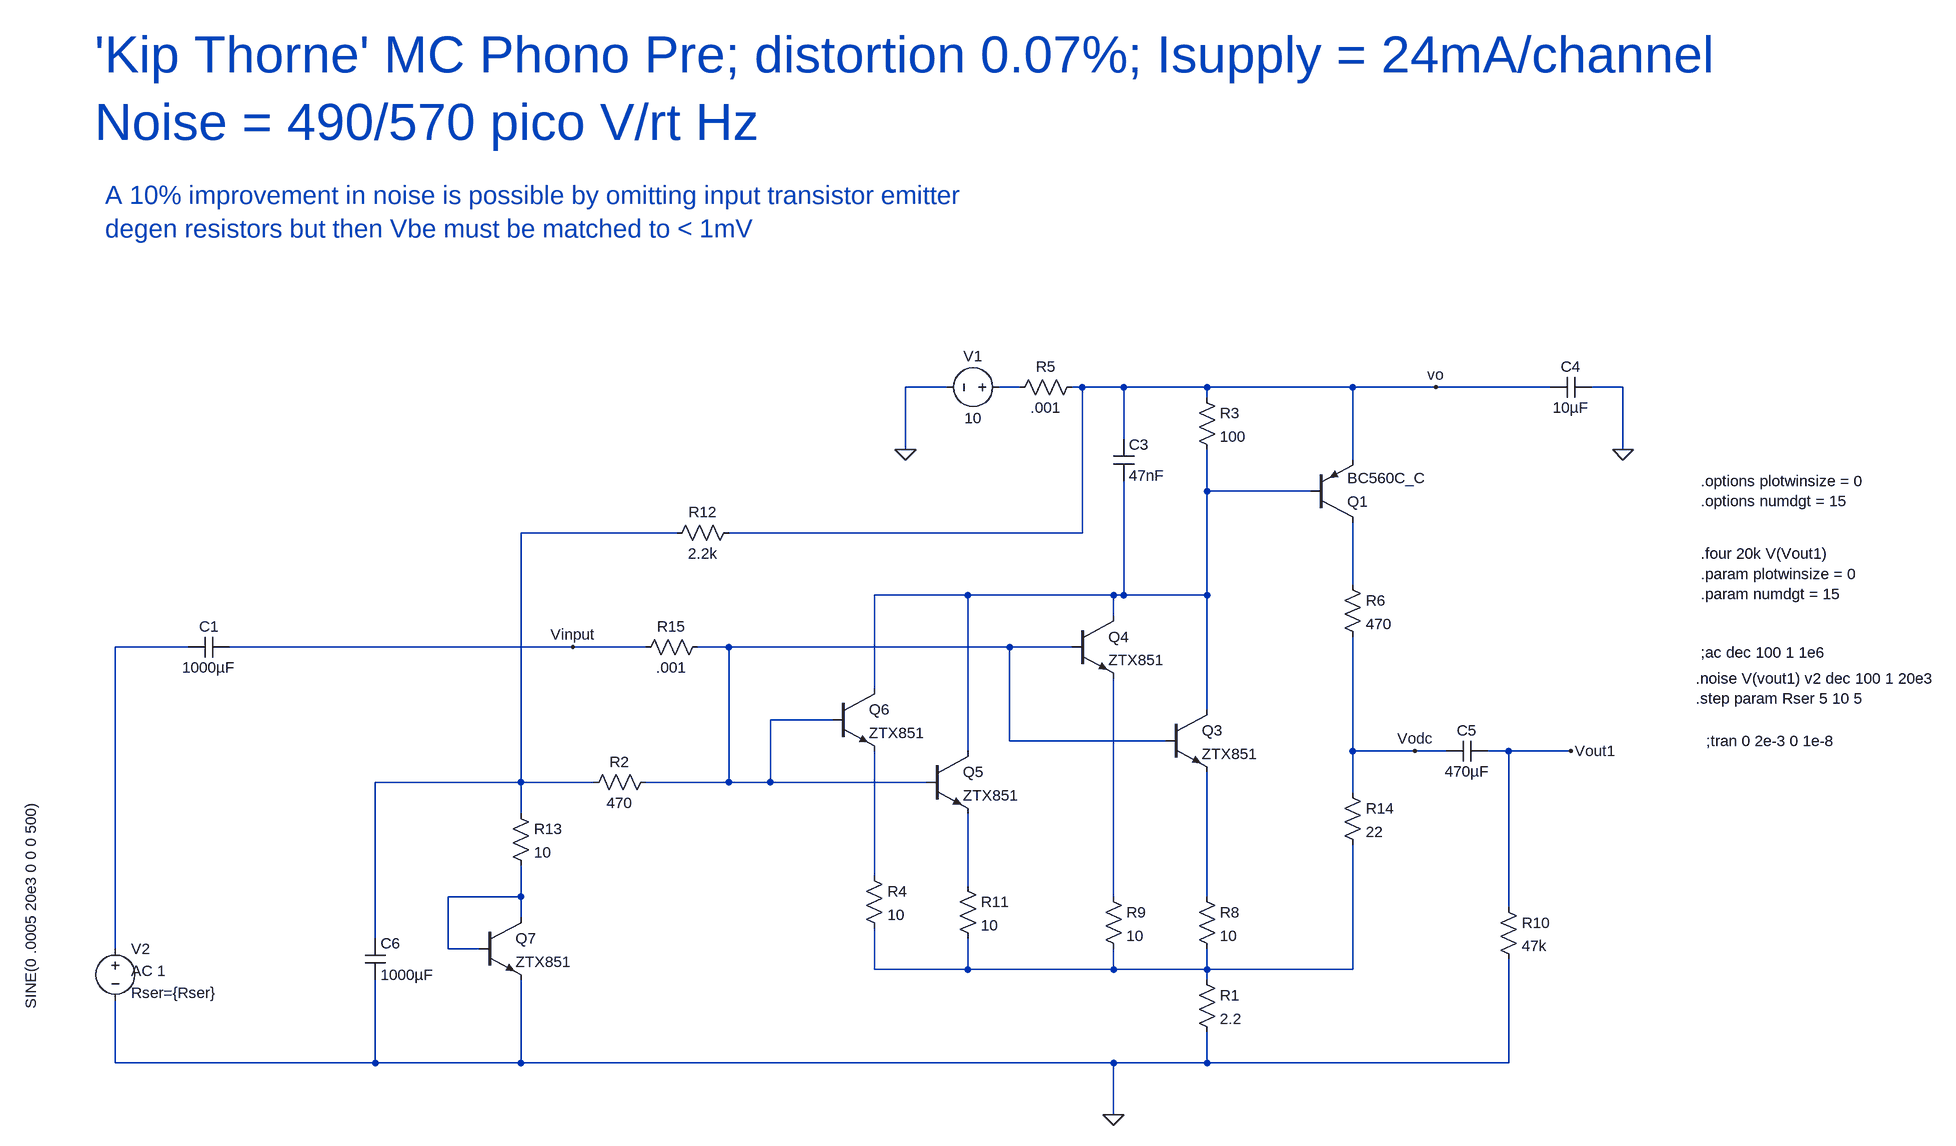
[diagram p0: schematic Kip Thorne.asc]
Kip Thorne.asc, the LTspice schematic file:
Version 4
SHEET 1 2144 760
WIRE 208 -384 144 -384
WIRE 320 -384 288 -384
WIRE 416 -384 400 -384
WIRE 480 -384 416 -384
WIRE 608 -384 480 -384
WIRE 832 -384 608 -384
WIRE 960 -384 832 -384
WIRE 1136 -384 960 -384
WIRE 1248 -384 1200 -384
WIRE 608 -368 608 -384
WIRE 480 -304 480 -384
WIRE 144 -288 144 -384
WIRE 1248 -288 1248 -384
WIRE 832 -272 832 -384
WIRE 608 -224 608 -288
WIRE 768 -224 608 -224
WIRE -208 -160 -448 -160
WIRE 416 -160 416 -384
WIRE 416 -160 -128 -160
WIRE 832 -80 832 -176
WIRE 240 -64 96 -64
WIRE 464 -64 240 -64
WIRE 480 -64 480 -240
WIRE 480 -64 464 -64
WIRE 608 -64 608 -224
WIRE 608 -64 480 -64
WIRE 464 -32 464 -64
WIRE -960 16 -1072 16
WIRE -368 16 -896 16
WIRE -256 16 -368 16
WIRE -128 16 -176 16
WIRE 304 16 -128 16
WIRE 400 16 304 16
WIRE 96 80 96 -64
WIRE 608 112 608 -64
WIRE 32 128 -64 128
WIRE 304 160 304 16
WIRE 544 160 304 160
WIRE 240 176 240 -64
WIRE 832 176 832 0
WIRE 928 176 832 176
WIRE 976 176 928 176
WIRE 1072 176 1040 176
WIRE 1168 176 1072 176
WIRE -448 224 -448 -160
WIRE -448 224 -672 224
WIRE -336 224 -448 224
WIRE -128 224 -128 16
WIRE -128 224 -256 224
WIRE -64 224 -64 128
WIRE -64 224 -128 224
WIRE 176 224 -64 224
WIRE 832 240 832 176
WIRE -448 272 -448 224
WIRE 96 368 96 176
WIRE 240 384 240 272
WIRE -448 400 -448 352
WIRE -448 400 -560 400
WIRE 464 400 464 64
WIRE 608 400 608 208
WIRE 1072 416 1072 176
WIRE -448 432 -448 400
WIRE -672 464 -672 224
WIRE -1072 480 -1072 16
WIRE -560 480 -560 400
WIRE -512 480 -560 480
WIRE 96 512 96 448
WIRE 240 512 240 464
WIRE 240 512 96 512
WIRE 464 512 464 480
WIRE 464 512 240 512
WIRE 608 512 608 480
WIRE 608 512 464 512
WIRE 832 512 832 320
WIRE 832 512 608 512
WIRE 608 528 608 512
WIRE -1072 656 -1072 560
WIRE -672 656 -672 528
WIRE -672 656 -1072 656
WIRE -448 656 -448 528
WIRE -448 656 -672 656
WIRE 464 656 -448 656
WIRE 608 656 608 608
WIRE 608 656 464 656
WIRE 1072 656 1072 496
WIRE 1072 656 608 656
WIRE 464 736 464 656
FLAG 464 736 0
FLAG 144 -288 0
FLAG 1248 -288 0
FLAG 1168 176 Vout1
FLAG 928 176 Vodc
FLAG 960 -384 vo
FLAG -368 16 Vinput
SYMBOL res 592 512 R0
SYMATTR InstName R1
SYMATTR Value 2.2
SYMBOL res 592 -384 R0
SYMATTR InstName R3
SYMATTR Value 100
SYMBOL voltage 304 -384 R90
WINDOW 0 -32 56 VBottom 2
WINDOW 3 32 56 VTop 2
WINDOW 123 2 56 VBottom 2
WINDOW 39 0 0 Left 2
SYMATTR InstName V1
SYMATTR Value 10
SYMBOL voltage -1072 464 R0
WINDOW 3 -130 -213 VRight 2
WINDOW 123 24 50 Left 2
WINDOW 39 24 84 Left 2
SYMATTR Value SINE(0 .0005 20e3 0 0 0 500)
SYMATTR Value2 AC 1
SYMATTR SpiceLine Rser={Rser}
SYMATTR InstName V2
SYMBOL cap 1200 -400 R90
WINDOW 0 0 32 VBottom 2
WINDOW 3 32 32 VTop 2
SYMATTR InstName C4
SYMATTR Value 10µF
SYMBOL pnp 768 -176 M180
SYMATTR InstName Q1
SYMATTR Value BC560C_C
SYMBOL cap 464 -304 R0
SYMATTR InstName C3
SYMATTR Value 47nF
SYMBOL cap 1040 160 R90
WINDOW 0 0 32 VBottom 2
WINDOW 3 32 32 VTop 2
SYMATTR InstName C5
SYMATTR Value 470µF
SYMBOL res 1056 400 R0
SYMATTR InstName R10
SYMATTR Value 47k
SYMBOL res 592 384 R0
SYMATTR InstName R8
SYMATTR Value 10
SYMBOL res 448 384 R0
SYMATTR InstName R9
SYMATTR Value 10
SYMBOL res 224 368 R0
SYMATTR InstName R11
SYMATTR Value 10
SYMBOL npn 544 112 R0
SYMATTR InstName Q3
SYMATTR Value ZTX851
SYMBOL npn 400 -32 R0
SYMATTR InstName Q4
SYMATTR Value ZTX851
SYMBOL npn 176 176 R0
SYMATTR InstName Q5
SYMATTR Value ZTX851
SYMBOL res -112 -176 R90
WINDOW 0 0 56 VBottom 2
WINDOW 3 32 56 VTop 2
SYMATTR InstName R12
SYMATTR Value 2.2k
SYMBOL cap -896 0 R90
WINDOW 0 0 32 VBottom 2
WINDOW 3 32 32 VTop 2
SYMATTR InstName C1
SYMATTR Value 1000µF
SYMBOL res 816 224 R0
SYMATTR InstName R14
SYMATTR Value 22
SYMBOL npn 32 80 R0
SYMATTR InstName Q6
SYMATTR Value ZTX851
SYMBOL res 80 352 R0
SYMATTR InstName R4
SYMATTR Value 10
SYMBOL npn -512 432 R0
SYMATTR InstName Q7
SYMATTR Value ZTX851
SYMBOL res -240 208 R90
WINDOW 0 0 56 VBottom 2
WINDOW 3 32 56 VTop 2
SYMATTR InstName R2
SYMATTR Value 470
SYMBOL res -464 256 R0
SYMATTR InstName R13
SYMATTR Value 10
SYMBOL res -160 0 R90
WINDOW 0 0 56 VBottom 2
WINDOW 3 32 56 VTop 2
SYMATTR InstName R15
SYMATTR Value .001
SYMBOL cap -688 464 R0
SYMATTR InstName C6
SYMATTR Value 1000µF
SYMBOL res 416 -400 R90
WINDOW 0 0 56 VBottom 2
WINDOW 3 32 56 VTop 2
SYMATTR InstName R5
SYMATTR Value .001
SYMBOL res 816 -96 R0
SYMATTR InstName R6
SYMATTR Value 470
TEXT 1368 24 Left 2 !;ac dec 100 1 1e6
TEXT 1376 160 Left 2 !;tran 0 2e-3 0 1e-8
TEXT 1360 64 Left 2 !.noise V(vout1) v2 dec 100 1 20e3\n.step param Rser 5 10 5
TEXT 1368 -128 Left 2 !.four 20k V(Vout1)\n.param plotwinsize = 0\n.param numdgt = 15
TEXT 1368 -240 Left 2 !.options plotwinsize = 0\n.options numdgt = 15
TEXT -1104 -896 Left 6 ;'Kip Thorne' MC Phono Pre; distortion 0.07%; Isupply = 24mA/channel\nNoise = 490/570 pico V/rt Hz
TEXT -1088 -680 Left 4 ;A 10% improvement in noise is possible by omitting input transistor emitter\ndegen resistors but then Vbe must be matched to < 1mV

The netlist it stands for:
* Kip Thorne.asc
R1 N012 0 2.2
R3 vo N002 100
V1 N001 0 10
V2 N005 0 SINE(0 .0005 20e3 0 0 0 500) AC 1 Rser={Rser}
C4 0 vo 10µF
Q1 N004 N002 vo 0 BC560C_C
C3 vo N002 47nF
C5 Vout1 Vodc 470µF
R10 Vout1 0 47k
R8 N011 N012 10
R9 N010 N012 10
R11 N008 N012 10
Q3 N002 N006 N011 0 ZTX851
Q4 N002 N006 N010 0 ZTX851
Q5 N002 N006 N008 0 ZTX851
R12 vo N003 2.2k
C1 Vinput N005 1000µF
R14 Vodc N012 22
Q6 N002 N006 N007 0 ZTX851
R4 N007 N012 10
Q7 N009 N009 0 0 ZTX851
R2 N006 N003 470
R13 N003 N009 10
R15 N006 Vinput .001
C6 N003 0 1000µF
R5 vo N001 .001
R6 N004 Vodc 470
.model NPN NPN
.model PNP PNP
.lib standard.bjt
;ac dec 100 1 1e6
;tran 0 2e-3 0 1e-8
.noise V(vout1) v2 dec 100 1 20e3
.step param Rser 5 10 5
.four 20k V(Vout1)
.param plotwinsize = 0
.param numdgt = 15
.options plotwinsize = 0
.options numdgt = 15
* 'Kip Thorne' MC Phono Pre; distortion 0.07%; Isupply = 24mA/channel
* Noise = 490/570 pico V/rt Hz
* A 10% improvement in noise is possible by omitting input transistor emitter
* degen resistors but then Vbe must be matched to < 1mV
.backanno
.end